# EAGLE design LEPTON (EAGLE 9.1.2)
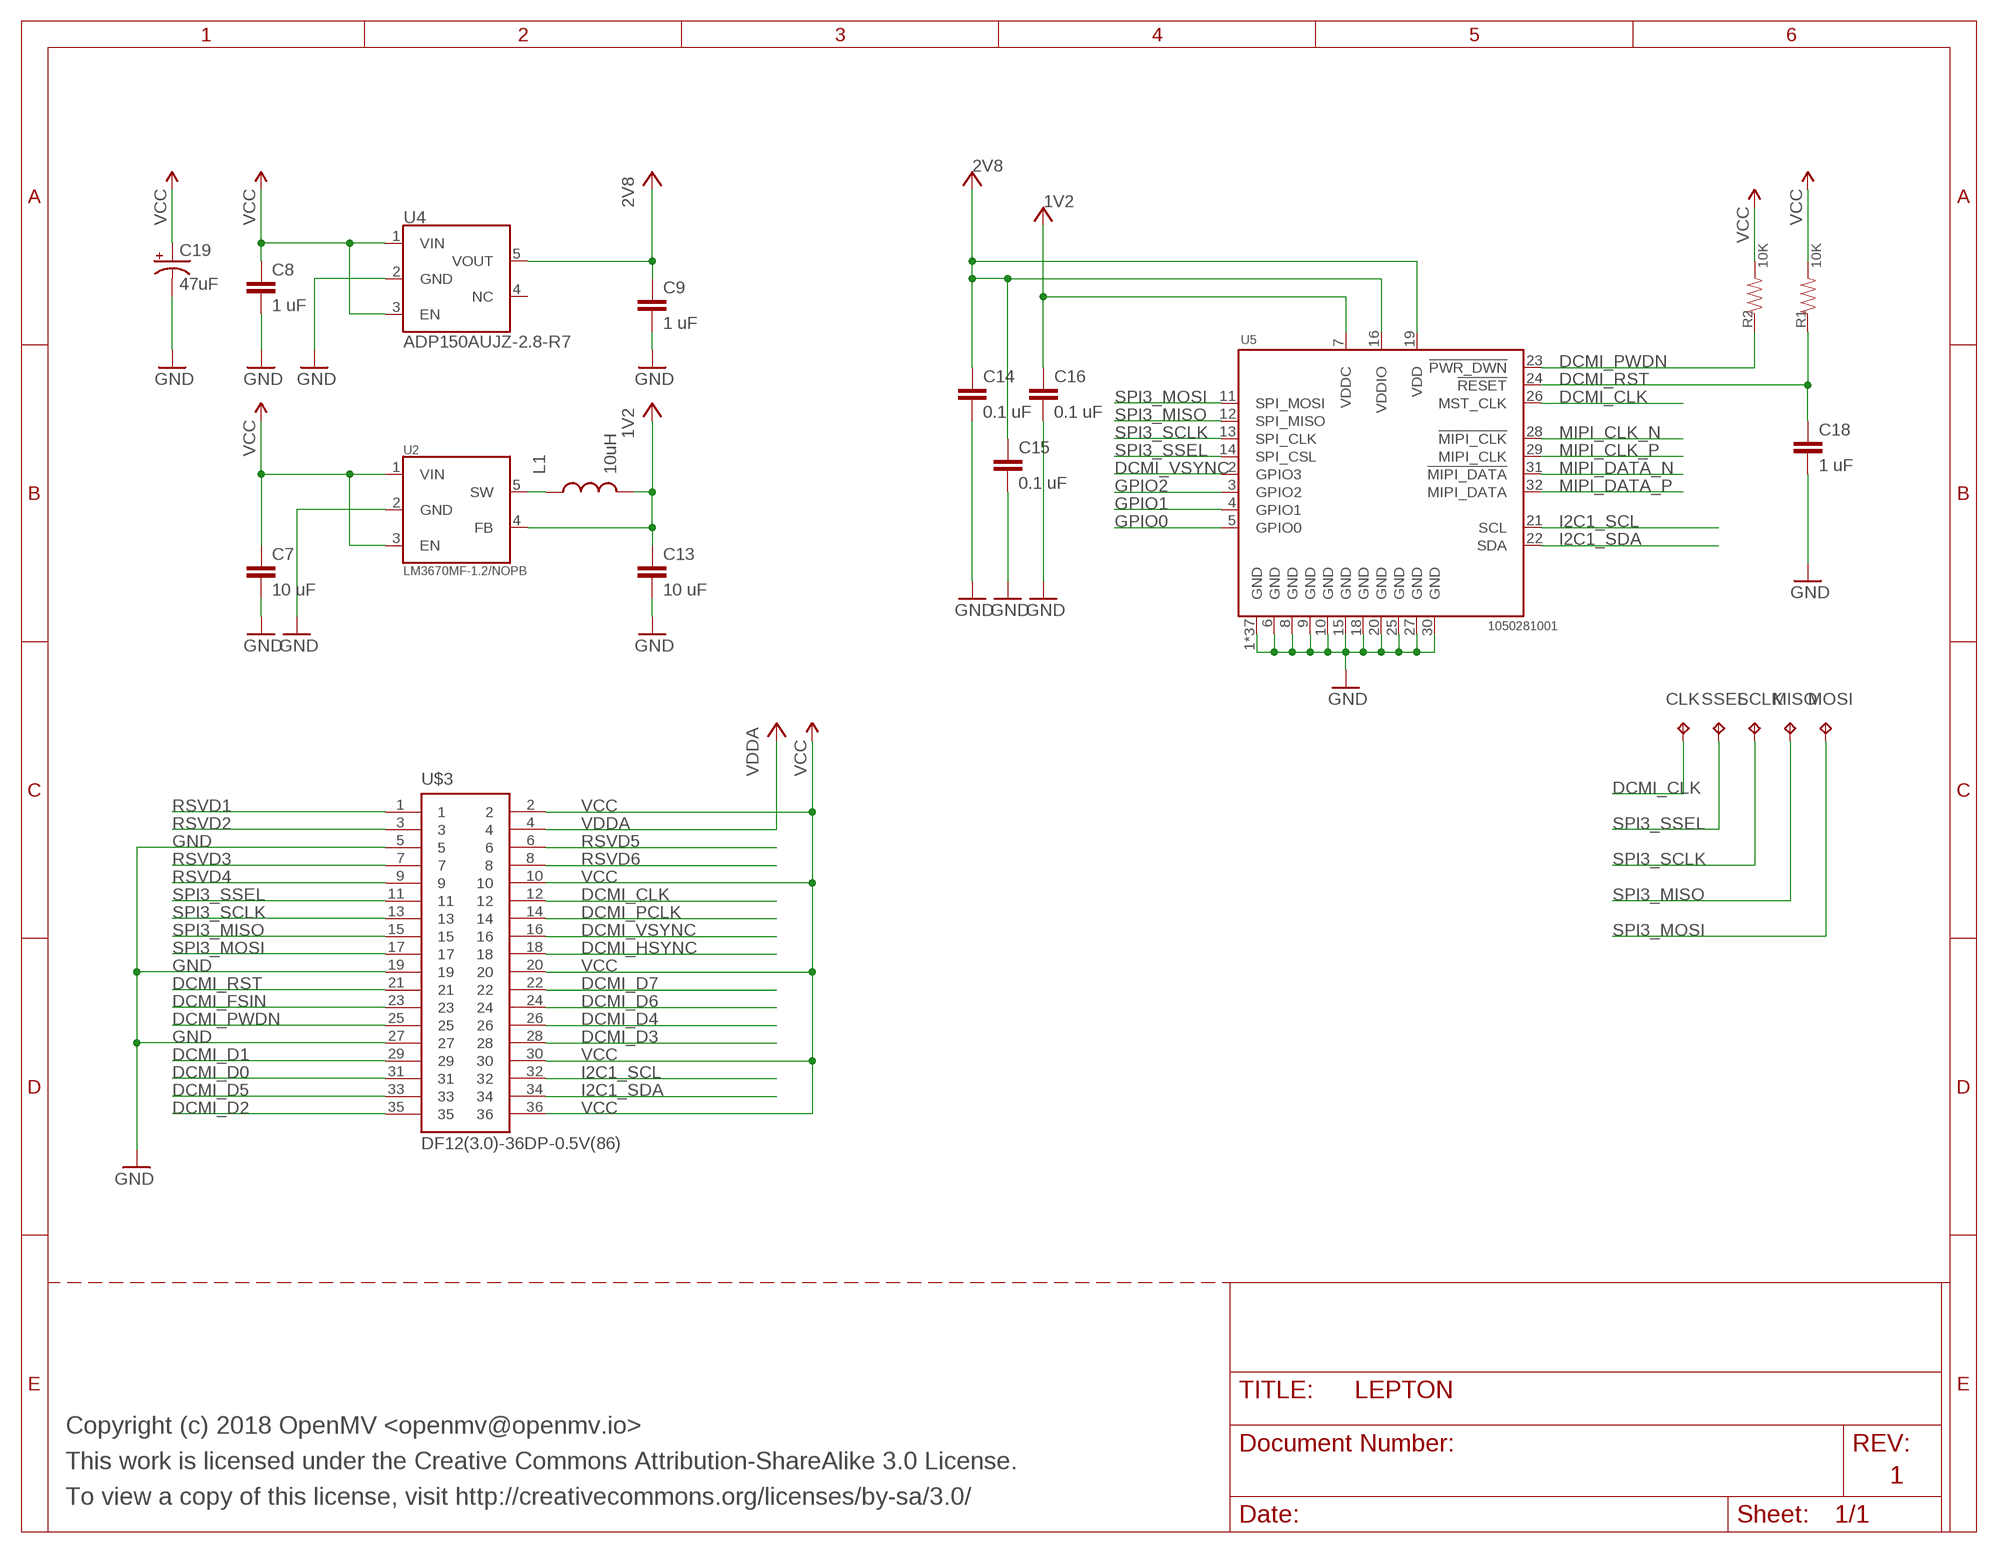
[diagram p0: schematic, sheet 1]

## Parts
C7  10 uF  CAP0805  [0805]
C8  1 uF  CAP0402-CAP  [0402-CAP]
C9  1 uF  CAP0402-CAP  [0402-CAP]
C13  10 uF  CAP0805  [0805]
C14  0.1 uF  CAP0402-CAP  [0402-CAP]
C15  0.1 uF  CAP0402-CAP  [0402-CAP]
C16  0.1 uF  CAP0402-CAP  [0402-CAP]
C18  1 uF  CAP0402-CAP  [0402-CAP]
C19  47uF  CAP_POL1206  [EIA3216]
CLK  TPTP16R  [TP16R]
L1  10uH  INDUCTOR1210  [1210]
MISO  TPTP16R  [TP16R]
MOSI  TPTP16R  [TP16R]
R1  10K  RESISTOR0402-RES  [0402-RES]
R2  10K  RESISTOR0402-RES  [0402-RES]
SCLK  TPTP16R  [TP16R]
SSEL  TPTP16R  [TP16R]
U2  LM3670MF-1.2/NOPB  LM3670SOT23-5  [SOT23-5]
U4  ADP150AUJZ-2.8-R7  ADP150TSOT-5  [SOT23-5]
U5  1050281001  CAM-MODULE  [CAM-SOCKET]
U$3  DF12(3.0)-36DP-0.5V(86)  DF12-36-DP  [DF12-36-DP]

## Nets
1V2: C13.1 C16.1 L1.2 U2.4(FB) U5.7(VDDC)
2V8: C9.1 C14.1 C15.1 U4.5(VOUT) U5.16(VDDIO) U5.19(VDD)
DCMI_CLK: CLK.TP U5.26(MST_CLK) U$3.12
DCMI_D0: U$3.31
DCMI_D1: U$3.29
DCMI_D2: U$3.35
DCMI_D3: U$3.28
DCMI_D4: U$3.26
DCMI_D5: U$3.33
DCMI_D6: U$3.24
DCMI_D7: U$3.22
DCMI_FSIN: U$3.23
DCMI_HSYNC: U$3.18
DCMI_PCLK: U$3.14
DCMI_PWDN: R2.1 U5.23(!PWR_DWN) U$3.25
DCMI_RST: C18.1 R1.1 U5.24(!RESET) U$3.21
DCMI_VSYNC: U5.2(GPIO3) U$3.16
GND: C7.2 C8.2 C9.2 C13.2 C14.2 C15.2 C16.2 C18.2 C19.C(-) U2.2(GND) U4.2(GND) U5.1(GND) U5.6(GND) U5.8(GND) U5.9(GND) U5.10(GND) U5.15(GND) U5.18(GND) U5.20(GND) U5.25(GND) U5.27(GND) U5.30(GND) U5.P$1(GND) U5.P$2(GND) U5.P$3(GND) U5.P$4(GND) U5.P$5(GND) U5.P$6(GND) U5.P$7(GND) U5.P$8(GND) U5.P$9(GND) U5.P$10(GND) U5.P$11(GND) U5.P$12(GND) U5.P$13(GND) U5.P$14(GND) U5.P$15(GND) U5.P$16(GND) U5.P$17(GND) U5.P$18(GND) U5.P$19(GND) U5.P$20(GND) U5.P$21(GND) U5.P$22(GND) U5.P$23(GND) U5.P$24(GND) U5.P$25(GND) U5.P$26(GND) U5.P$27(GND) U5.P$28(GND) U5.P$29(GND) U5.P$30(GND) U5.P$31(GND) U5.P$32(GND) U5.P$33(GND) U5.P$34(GND) U5.P$35(GND) U5.P$36(GND) U$3.5 U$3.19 U$3.27
GPIO0: U5.5(GPIO0)
GPIO1: U5.4(GPIO1)
GPIO2: U5.3(GPIO2)
I2C1_SCL: U5.21(SCL) U$3.32
I2C1_SDA: U5.22(SDA) U$3.34
MIPI_CLK_N: U5.28(!MIPI_CLK)
MIPI_CLK_P: U5.29(MIPI_CLK)
MIPI_DATA_N: U5.31(!MIPI_DATA)
MIPI_DATA_P: U5.32(MIPI_DATA)
N$1: L1.1 U2.5(SW)
RSVD1: U$3.1
RSVD2: U$3.3
RSVD3: U$3.7
RSVD4: U$3.9
RSVD5: U$3.6
RSVD6: U$3.8
SPI3_MISO: MISO.TP U5.12(SPI_MISO) U$3.15
SPI3_MOSI: MOSI.TP U5.11(SPI_MOSI) U$3.17
SPI3_SCLK: SCLK.TP U5.13(SPI_CLK) U$3.13
SPI3_SSEL: SSEL.TP U5.14(SPI_CSL) U$3.11
VCC: C7.1 C8.1 C19.A(+) R1.2 R2.2 U2.1(VIN) U2.3(EN) U4.1(VIN) U4.3(EN) U$3.2 U$3.10 U$3.20 U$3.30 U$3.36
VDDA: U$3.4
Unconnected: U4.4(NC)

## Notes on the sheet
- Copyright (c) 2018 OpenMV <openmv@openmv.io>
- This work is licensed under the Creative Commons Attribution-ShareAlike 3.0 License.
- 1
- To view a copy of this license, visit http://creativecommons.org/licenses/by-sa/3.0/

## Library data of the parts
C7-C9 C13-C16 C18 = SparkFun-Capacitors:CAP: Capacitor Standard 0603 ceramic capacitor, and 0.1" leaded capacitor.
C19 = sfe:CAP_POL: Capacitor Polarized These are standard SMD and PTH capacitors. Normally 10uF, 47uF, and 100uF in electrolytic and tantalum varieties. Always verify the external diameter of the through hole cap, it varies with capacity, voltage, and manufacturer. The EIA devices should be standard.
CLK MISO MOSI SCLK SSEL = testpad:TP: Test pad
L1 = sfe:INDUCTOR: Inductors Basic Inductor/Choke - 0603 and 1206. Footprints are not proven and vary greatly between part numbers.
R1 R2 = sfe:RESISTOR: Resistor Basic schematic elements and footprints for 0603, 1206, and PTH resistors.
U2 = leptonCustom:LM3670: LM3670 1.2V 350mA Mini Buck Converter TI LM3670MF-1.2/NOPB
U4 = leptonCustom:ADP150: ADP150 2.8V 150mA Linear LDO Regulator Analog Devices ADP150AUJZ-2.8-R7
U5 = leptonCustom:CAM-MODULE: FLIR Lepton 80x60 LWIR camera module.
U$3 = DF12:DF12-36-DP

## Board
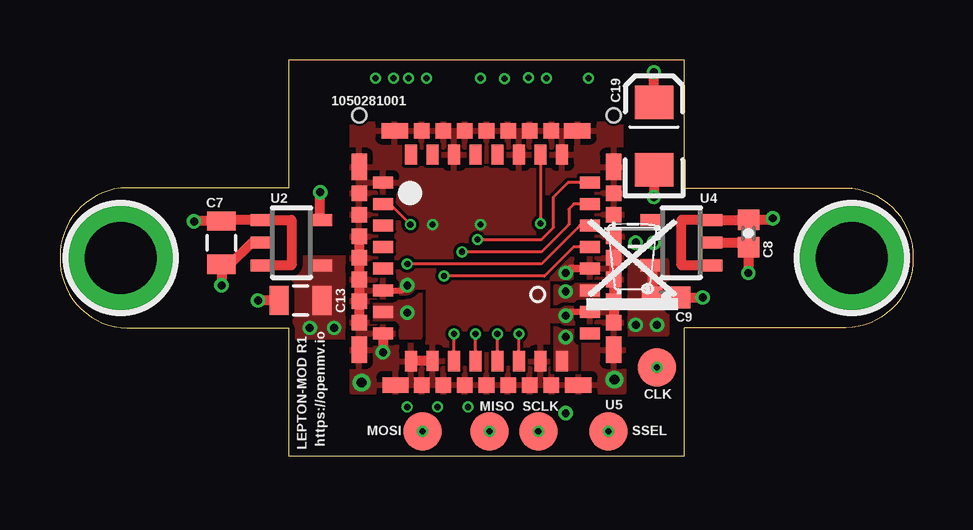
[diagram p1: board, top side]
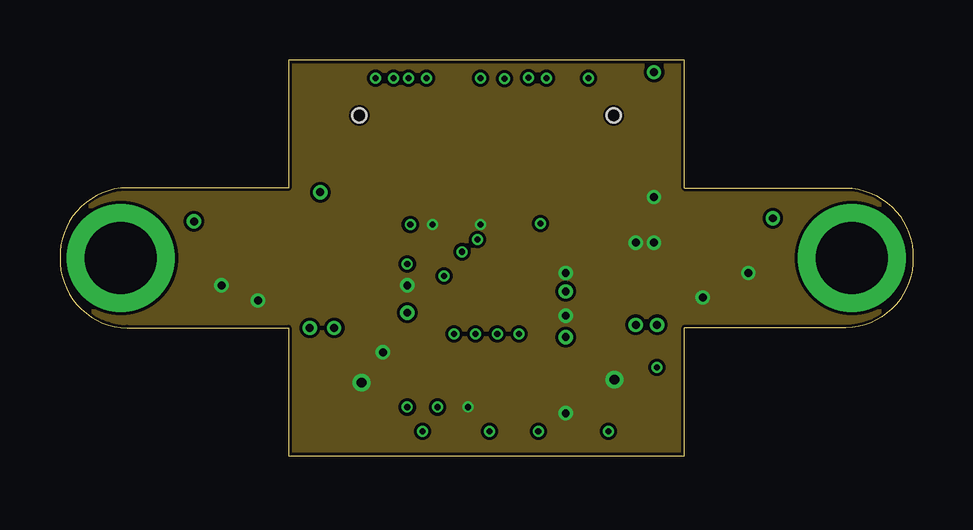
[diagram p2: board, inner layer GND]
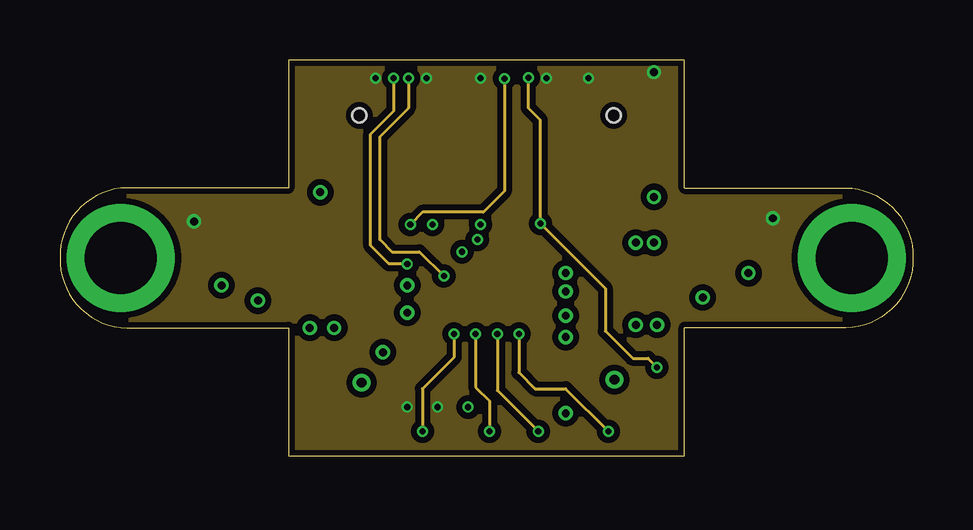
[diagram p3: board, inner layer VCC]
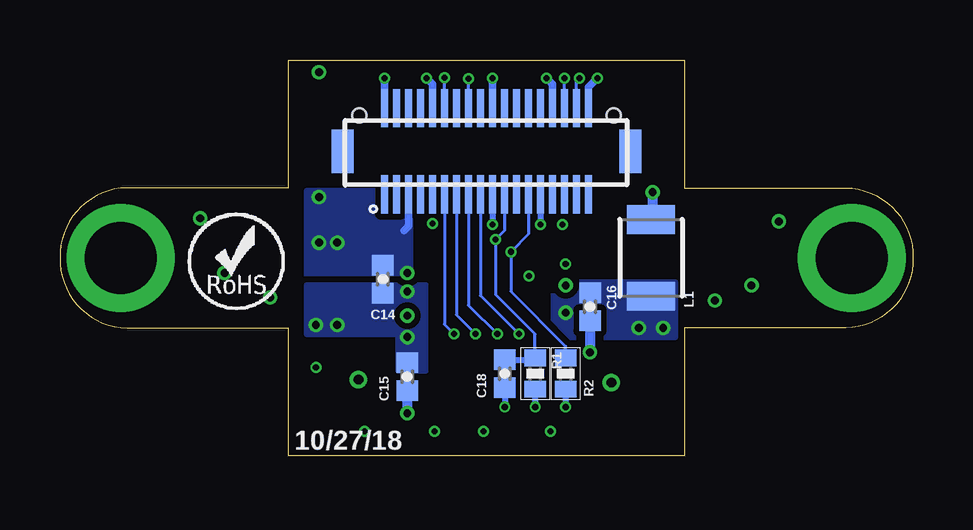
[diagram p4: board, bottom side, seen from below]

Size 35.56 x 16.51 mm. Coordinates in mm from the lower left corner, seen from the top.
Outline: 9.53,16.51 9.53,11.18 2.79,11.18 arc90 0,8.26 arc90 2.79,5.33 9.53,5.33 9.53,0 26.04,0 26.04,5.33 32.77,5.33 arc90 35.56,8.26 arc90 32.77,11.18 26.04,11.18 26.04,16.51 9.53,16.51
Copper layers (1*2+15*16): Top 0.035mm / dielectric 1.5mm / GND 0.035mm / dielectric 0.15mm / VCC 0.035mm / dielectric 0.2mm / Bottom 0.035mm
Design rules "default": minimum track width 5mil, minimum drill 10mil, track to track 5mil, track to pad 5mil, pad to pad 5mil, via to via 5mil, smd to smd 5mil, copper to edge 5mil, drill to drill 10mil, minimum pad ring 10mil, minimum via ring 4mil, stop-mask expansion 2mil, vias tented up to drill 30mil, thermal gap 10mil

### Footprints (pad centres in the part's own frame; a part is rotated, then mirrored left to right if it is on the bottom)
0805 = smd 0.8 x 1.2: 1 -0.9,0; 2 0.9,0
0402-CAP = smd 0.85 x 0.9: 1 -0.58,0; 2 0.58,0
EIA3216 = smd 1.4 x 1.6: A 1.4,0; C -1.4,0
TP16R = smd 1.6 x 1.6: TP 0,0
1210 = smd 1.2 x 2: 1 -1.6,0; 2 1.6,0
0402-RES = smd 0.7 x 0.9: 1 -0.65,0; 2 0.65,0
SOT23-5 = smd 0.5 x 1: 1 -0.95,-1.2; 2 0,-1.2; 3 0.95,-1.2; 4 0.95,1.2; 5 -0.95,1.2
CAM-SOCKET = smd 0.5 x 0.84: 1 -3.15,-4.31; 2 -2.25,-4.31; 3 -1.35,-4.31; 4 -0.45,-4.31; 5 0.45,-4.31; 6 1.35,-4.31; 7 2.25,-4.31; 8 3.15,-4.31; 17 3.15,4.31; 18 2.25,4.31; 19 1.35,4.31; 20 0.45,4.31; 21 -0.45,4.31; 22 -1.35,4.31; 23 -2.25,4.31; 24 -3.15,4.31 | smd 0.84 x 0.5: 9 4.31,-3.15; 10 4.3,-2.25; 11 4.31,-1.35; 12 4.31,-0.45; 13 4.31,0.45; 14 4.31,1.35; 15 4.31,2.25; 16 4.31,3.15; 25 -4.31,3.15; 26 -4.31,2.25; 27 -4.31,1.35; 28 -4.31,0.45; 29 -4.31,-0.45; 30 -4.31,-1.35; 31 -4.31,-2.25; 32 -4.31,-3.15 | smd 0.65 x 0.65: P$1 -5.305,2.7; P$3 -5.305,1.8; P$4 -5.305,0.9; P$5 -5.305,0; P$6 -5.305,-0.9; P$7 -5.305,-1.8; P$8 -5.305,-2.7; P$11 -2.7,5.305; P$12 -1.8,5.305; P$13 -0.9,5.305; P$14 0,5.305; P$15 0.9,5.305; P$16 1.8,5.305; P$17 2.7,5.305; P$20 5.305,-2.7; P$21 5.305,-1.8; P$22 5.305,-0.9; P$23 5.305,0; P$24 5.305,0.9; P$25 5.305,1.8; P$26 5.305,2.7; P$29 -2.7,-5.305; P$30 -1.8,-5.305; P$31 -0.9,-5.305; P$32 0,-5.305; P$33 0.9,-5.305; P$34 1.8,-5.305; P$35 2.7,-5.305 | smd 0.65 x 1.1: P$2 -5.305,-3.83; P$9 -5.305,3.79; P$19 5.305,3.83; P$27 5.305,-3.79 | smd 1.1 x 0.65: P$10 3.83,5.305; P$18 -3.79,5.305; P$28 3.83,-5.305; P$36 -3.79,-5.305
DF12-36-DP = smd 0.3 x 1.6: 1 -4.25,-1.8; 2 -4.25,1.8; 3 -3.75,-1.8; 4 -3.75,1.8; 5 -3.25,-1.8; 6 -3.25,1.8; 7 -2.75,-1.8; 8 -2.75,1.8; 9 -2.25,-1.8; 10 -2.25,1.8; 11 -1.75,-1.8; 12 -1.75,1.8; 13 -1.25,-1.8; 14 -1.25,1.8; 15 -0.75,-1.8; 16 -0.75,1.8; 17 -0.25,-1.8; 18 -0.25,1.8; 19 0.25,-1.8; 20 0.25,1.8; 21 0.75,-1.8; 22 0.75,1.8; 23 1.25,-1.8; 24 1.25,1.8; 25 1.75,-1.8; 26 1.75,1.8; 27 2.25,-1.8; 28 2.25,1.8; 29 2.75,-1.8; 30 2.75,1.8; 31 3.25,-1.8; 32 3.25,1.8; 33 3.75,-1.8; 34 3.75,1.8; 35 4.25,-1.8; 36 4.25,1.8 | smd 0.9 x 1.8: F1 -6,0; F2 6,0 | hole 0.6: -5.3,1.5; 5.3,1.5

### Placement (x,y rotation side)
C7  6.73,8.89 270 top
C8  28.7,9.27 270 top
C9  25.27,6.6 0 top
C13  10.03,6.48 180 top
C14  22.1,7.37 90 bottom
C15  21.08,3.3 270 bottom
C16  13.46,6.22 270 bottom
C18  17.02,3.43 270 bottom
C19  24.77,13.34 90 top
CLK  24.89,3.68 0 top
L1  10.92,8.26 270 bottom
MISO  17.91,1.02 0 top
MOSI  15.11,1.02 0 top
R1  15.75,3.43 270 bottom
R2  14.48,3.43 270 bottom
SCLK  19.94,1.02 0 top
SSEL  22.86,1.02 0 top
U2  9.65,8.89 270 top
U4  25.91,8.89 90 top
U5  17.78,8.26 270 top
U$3  17.78,12.7 0 bottom
U$4  [WEEE]  21.97,6.1 0 top
U$5  [ROHS]  30.23,6.1 0 bottom

### Tracks (layer width: path | path; a pad name or v marks a point on that pad's centre or on a via)
1V2  (via drill 0.33)
  other vias: 11.43,5.33 14.48,5.97 10.41,5.33
  pour Top (isolate 0.254, no thermals): 9.78,8.26 14.99,8.26 14.99,4.95 9.78,4.95
  pour Bottom (isolate 0.254, no thermals): 9.91,7.24 14.99,7.24 14.99,4.95 9.91,4.95
2V8  (via drill 0.33)
  Top 0.406: U4.5 24.69,7.94 C9.1
  other vias: 24,5.46 24.89,5.46 21.08,6.86 21.08,4.95
  pour Top (isolate 0.254, no thermals): 20.7,7.11 23.5,7.11 23.5,8.13 25.27,8.13 25.27,5.08 21.46,5.08 21.46,3.56 20.7,3.56
  pour Bottom (isolate 0.254, no thermals): 20.32,7.11 25.27,7.11 25.27,5.08 21.46,5.08 21.46,3.56 20.32,3.56
DCMI_CLK  (via drill 0.25)
  Top 0.127: U5.26 v20.03,9.69
  VCC 0.127: v19.53,15.78 U$3.12 20.03,14 v20.03,9.69 22.73,6.99 22.73,5.21 23.88,4.06 24.51,4.06 CLK.TP
  Bottom 0.127: U$3.12 v19.53,15.78
  other vias: 24.89,3.68
DCMI_PWDN  (via drill 0.25)
  Top 0.127: v16.76,8.51 20.07,8.51 21.21,9.65 21.21,10.29 21.43,10.51 U5.23
  Bottom 0.127: U$3.25 16.03,9.24 v16.76,8.51 16.76,6.86 14.48,4.57 R2.1
DCMI_RST  (via drill 0.25)
  Top 0.127: U5.24 21.18,11.4 20.57,10.79 20.57,9.53 20.07,9.02 v17.4,9.02
  Bottom 0.127: U$3.21 17.03,9.39 v17.4,9.02 17.4,6.73 15.75,5.08 R1.1
  Bottom 0.254: C18.1 15.82,4.01 R1.1
DCMI_VSYNC  (via drill 0.25)
  Top 0.127: U5.2 13.75,10.51 v14.61,9.65
  VCC 0.127: v18.53,15.74 18.53,11.04 17.65,10.16 15.11,10.16 v14.61,9.65
  Bottom 0.127: U$3.16 v18.53,15.74
GND  (via drill 0.25, 0.33, 0.41)
  Top 0.254: U5.18 21.25,6 v21.08,5.84 | U5.6 14.27,6.91 v14.48,7.11
  Top 0.305: U5.20 21.27,7.8 v21.08,7.62
  Top 0.406: U5.10 U5.9 | v28.7,7.62 C8.2 28.7,8.89 U4.2 | C9.2 v26.8,6.6 | v6.73,7.11 C7.2 7.1,7.99 8,8.89 U2.2 | C13.2 v8.26,6.48 | C19.C v24.77,10.79 | U5.P$13 U5.P$14 U5.P$15 U5.P$16 U5.P$17 | U5.P$31 U5.P$32 U5.P$33 U5.P$34 U5.P$35 | U5.8 v13.47,4.33 v13.46,4.32
  Bottom 0.254: U$3.27 v15.53,9.65 | U$3.19 v17.53,9.65 | C18.2 v17.02,2.03
  Bottom 0.305: U$3.5 21.03,9.58 21.21,9.4
  Bottom 0.406: C16.2 v13.46,4.32 | C15.2 v21.08,1.78
  other vias: 23.11,3.17 12.57,3.05 24.77,8.89 24,8.89
  pour GND (rank 2): 9.65,16.26 25.91,16.26 25.91,11.18 35.56,11.18 35.56,5.33 25.91,5.33 25.91,0.25 9.65,0.25 9.65,5.33 0,5.33 0,11.18 9.65,11.18
  pour Top (rank 2): 12.19,13.84 23.37,13.84 23.5,2.67 12.19,2.67
  pour Bottom (isolate 0.254, rank 2, no thermals): 20.95,11.05 25.27,11.05 25.27,7.49 20.95,7.49
I2C1_SCL  (via drill 0.25)
  Top 0.127: U5.21 21.41,8.71 20.19,7.49 v16,7.49
  VCC 0.127: v14.53,15.75 U$3.32 13.34,13.3 13.34,9.02 13.84,8.51 14.99,8.51 v16,7.49
  Bottom 0.127: U$3.32 v14.53,15.75
I2C1_SDA  (via drill 0.25)
  Top 0.127: U5.22 21.67,9.61 20.07,8 v14.48,8
  VCC 0.127: v13.9,15.75 13.9,14.37 12.95,13.42 12.95,8.76 13.72,8 v14.48,8
  Bottom 0.127: U$3.34 14.03,15.62 v13.9,15.75
N$1  (via drill 0.33)
  Top 0.406: U2.5 v10.85,10.99
  Bottom 0.406: v10.85,10.99 10.85,9.93 L1.1
N$2  (via drill 3 pad 4.5)
  other vias: 2.54,8.26
N$4  (via drill 3 pad 4.5)
  other vias: 33.02,8.26
SPI3_MISO  (via drill 0.25)
  Top 0.127: U5.12 v17.33,5.08
  VCC 0.127: v17.33,5.08 17.33,2.86 17.91,2.29 MISO.TP
  Bottom 0.127: U$3.15 18.53,6.28 v17.33,5.08
  other vias: 17.91,1.02
SPI3_MOSI  (via drill 0.25)
  Top 0.127: U5.11 v16.43,5.08
  VCC 0.127: v16.43,5.08 16.43,4.11 15.11,2.79 MOSI.TP
  Bottom 0.127: U$3.17 18.03,6.68 v16.43,5.08
  other vias: 15.11,1.02
SPI3_SCLK  (via drill 0.25)
  Top 0.127: U5.13 v18.23,5.08
  VCC 0.127: v18.23,5.08 18.23,2.73 SCLK.TP
  Bottom 0.127: U$3.13 19.03,5.88 v18.23,5.08
  other vias: 19.94,1.02
SPI3_SSEL  (via drill 0.25)
  Top 0.127: U5.14 v19.13,5.08
  VCC 0.127: v19.13,5.08 19.13,3.48 19.81,2.79 21.08,2.79 SSEL.TP
  Bottom 0.127: U$3.11 19.53,5.48 v19.13,5.08
  other vias: 22.86,1.02
VCC  (via drill 0.25, 0.33)
  Top 0.406: U4.1 25.91,7.94 25.91,9.84 U4.3 C8.1 29.66,9.85 v29.72,9.91 | U2.3 9.65,7.94 9.65,9.84 U2.1 6.78,9.84 C7.1 v5.6,9.79 v5.59,9.78 | C19.A v24.77,16
  Bottom 0.254: R1.2 v15.75,2.03 | R2.2 v14.48,2.03
  Bottom 0.305: U$3.10 20.03,15.49 v20.28,15.75 | U$3.2 v22.03,15.75 | U$3.36 13.53,15.37 v13.15,15.75 | U$3.30 15.03,15.49 v15.28,15.75 | U$3.20 v17.53,15.75
  pour VCC (isolate 0.254, rank 2): 9.65,16.51 25.91,16.51 25.91,11.18 35.56,11.18 35.56,5.33 25.91,5.33 25.91,0.25 9.65,0.25 9.65,5.33 0,5.33 0,11.18 9.65,11.18

### Text on the board
tPlace: LEPTON-MOD R1 | https://openmv.io
bPlace: 10/27/18